# EAGLE design REV13.0 (EAGLE 9.2.2)
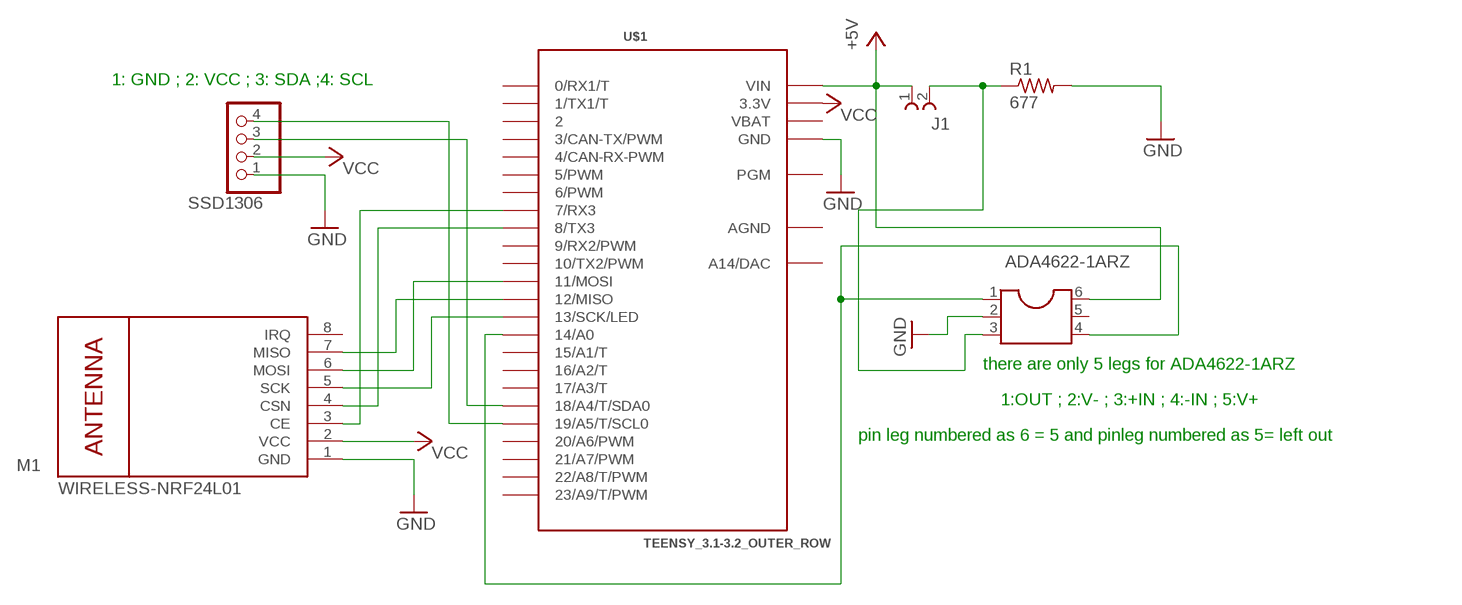
[diagram p0: schematic, sheet 1]

## Parts
ADA4622-1ARZ  DIL6/4  [DIL06-4]
J1  691214100002  [691214100002]
M1  WIRELESS-NRF24L01  [WIRELESS-NRF24L01]
R1  677  R-US_0204/5  [0204/5]
SSD1306  PINHD-1X4  [1X04]
U$1  TEENSY_3.1-3.2_OUTER_ROW  [TEENSY_3.0-3.2&LC_OUTER_ROW]

## Nets
+5V: ADA4622-1ARZ.6 J1.1 U$1.VIN
GND: ADA4622-1ARZ.2 M1.1(GND) R1.2 SSD1306.1 U$1.GND U$1.GND1(GND)
N$1: ADA4622-1ARZ.3 J1.2 R1.1
N$2: M1.5(SCK) U$1.13(13/SCK/LED)
N$3: M1.6(MOSI) U$1.11(11/MOSI)
N$4: M1.7(MISO) U$1.12(12/MISO)
N$5: M1.4(CSN) U$1.8(8/TX3)
N$6: M1.3(CE) U$1.7(7/RX3)
N$7: SSD1306.4 U$1.19/A5(19/A5/T/SCL0)
N$8: SSD1306.3 U$1.18/A4(18/A4/T/SDA0)
N$9: ADA4622-1ARZ.1 ADA4622-1ARZ.4 U$1.14/A0
VCC: M1.2(VCC) SSD1306.2 U$1.3.3V U$1.3.3V1(3.3V)
Unconnected: ADA4622-1ARZ.5 M1.8(IRQ) U$1.0(0/RX1/T) U$1.1(1/TX1/T) U$1.2 U$1.3(3/CAN-TX/PWM) U$1.4(4/CAN-RX-PWM) U$1.5(5/PWM) U$1.6(6/PWM) U$1.9(9/RX2/PWM) U$1.10(10/TX2/PWM) U$1.15/A1(15/A1/T) U$1.16/A2(16/A2/T) U$1.17/A3(17/A3/T) U$1.20/A6(20/A6/PWM) U$1.21/A7(21/A7/PWM) U$1.22/A8(22/A8/T/PWM) U$1.23/A9(23/A9/T/PWM) U$1.PGM U$1.RESET/DAC(A14/DAC)

## Notes on the sheet
- 1: GND ; 2: VCC ; 3: SDA ;4: SCL
- there are only 5 legs for ADA4622-1ARZ
- 1:OUT ; 2:V- ; 3:+IN ; 4:-IN ; 5:V+
- pin leg numbered as 6 = 5 and pinleg numbered as 5= left out

## Power pins joined to a net without a drawn wire
AGND: U$1.AGND
VBAT: U$1.VBAT

## Library data of the parts
ADA4622-1ARZ = ic-package:DIL6: Dual In Line / Socket
J1 = TerminalBlocks (rev17a):691214100002: SERIE 2141 - 3.50 MM - VERTICAL CABLE ENTRY WITH RISING CAGE CLAMP - WR-TBL =>ConTBL2 691214100002 Characteristics INSULATOR:PA6/66 FLAMABILITY RATING: UL94V0 COLOR: GREY METAL HOUSING: COPPER ALLOY / Ni+Sn TERMINAL SCREW: STEEL / Zn WIRE GUARD: COPPER ALLOY / Ni+Sn OPERATING TEMPERATURE:-30°C UP TO +120°C COMPLIANCE: LEAD FREE AND ROHS ELECTRICAL UL VDE CURRENT RATING: 10A 10A WORKING VOLTAGE: 300VAC 130VAC WITHSTANDING VOLTAGE: 1,6KV 1,25KV CONTACT RESISTANCE: 20 mOhm max 2015 (C) Wurth Elektronik
M1 = diy-modules:WIRELESS-NRF24L01: 2.4 GHz Wireless Module based on NRF24L01 chip More details available here: http://www.electrodragon.com/w/NRF24L01 Click here to find device on ebay.com <http://www.ebay.com/sch/nrf24l01+arduino>
R1 = adafruit:R-US_: RESISTOR, American symbol
SSD1306 = pinhead:PINHD-1X4: PIN HEADER
U$1 = Teensy_3_and_LC_Series_Boards_v1.4:TEENSY_3.1-3.2_OUTER_ROW: Footprint for Teensy 3.1 or 3.2 board using all pin connections on the outer perimeter

## Net classes
0 default: width 0.508 mm, drill 0.381 mm, clearance 0.381 mm

## Board
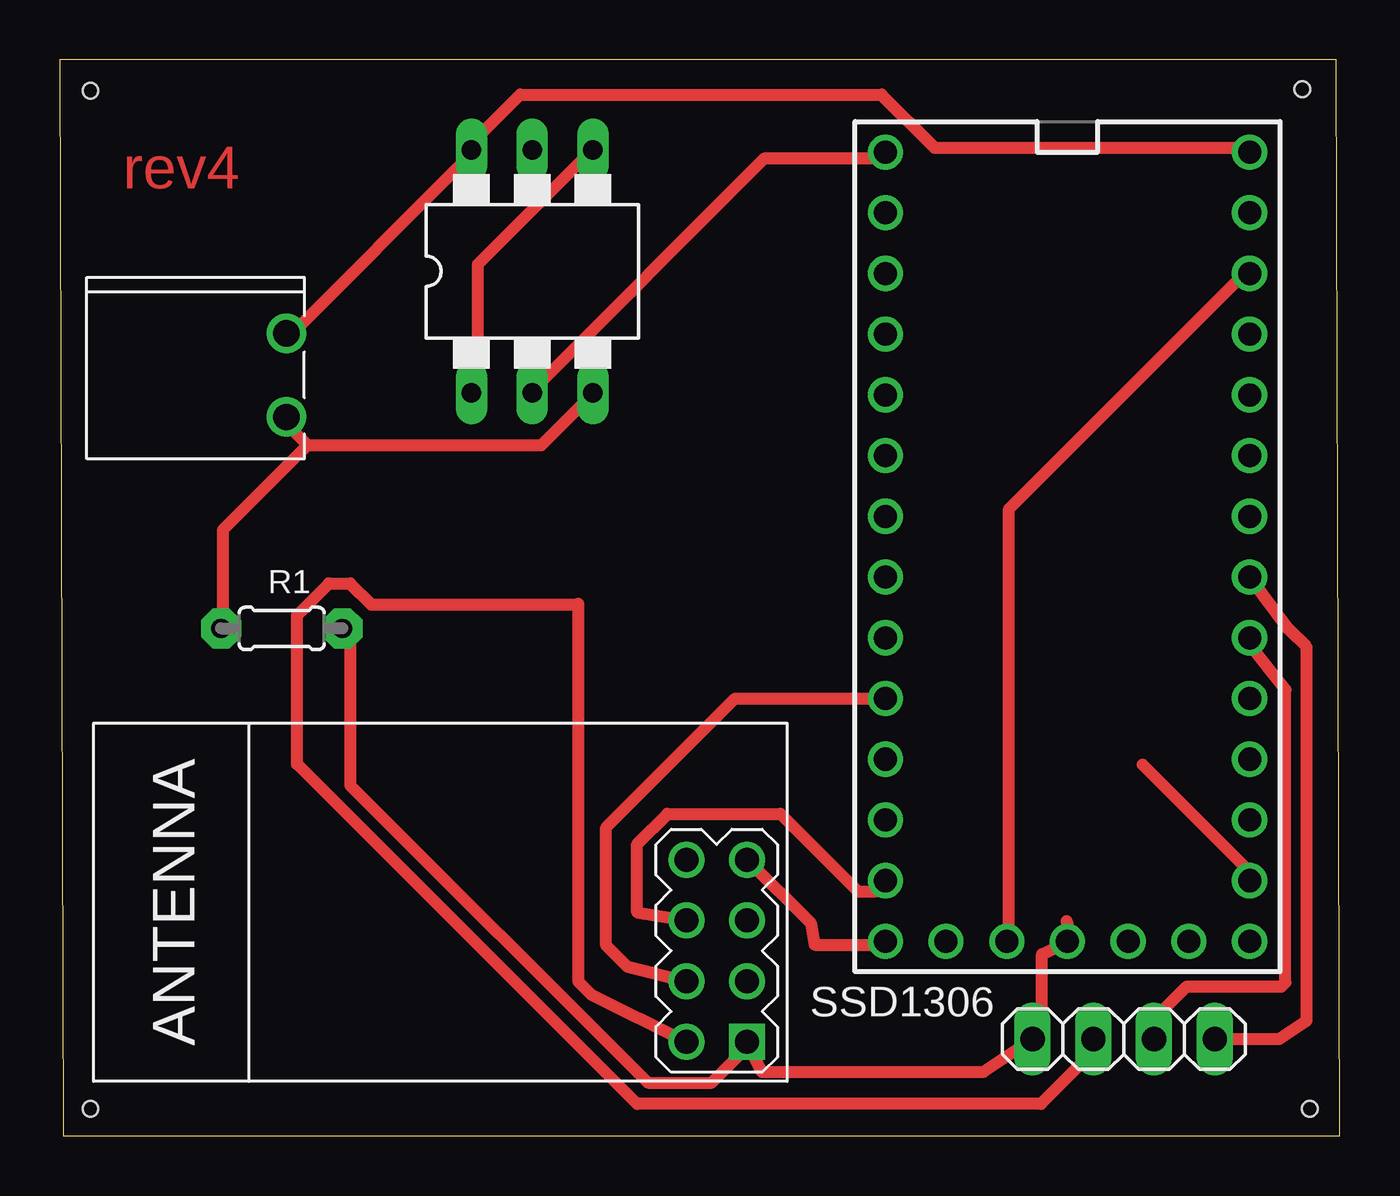
[diagram p1: board, top side]
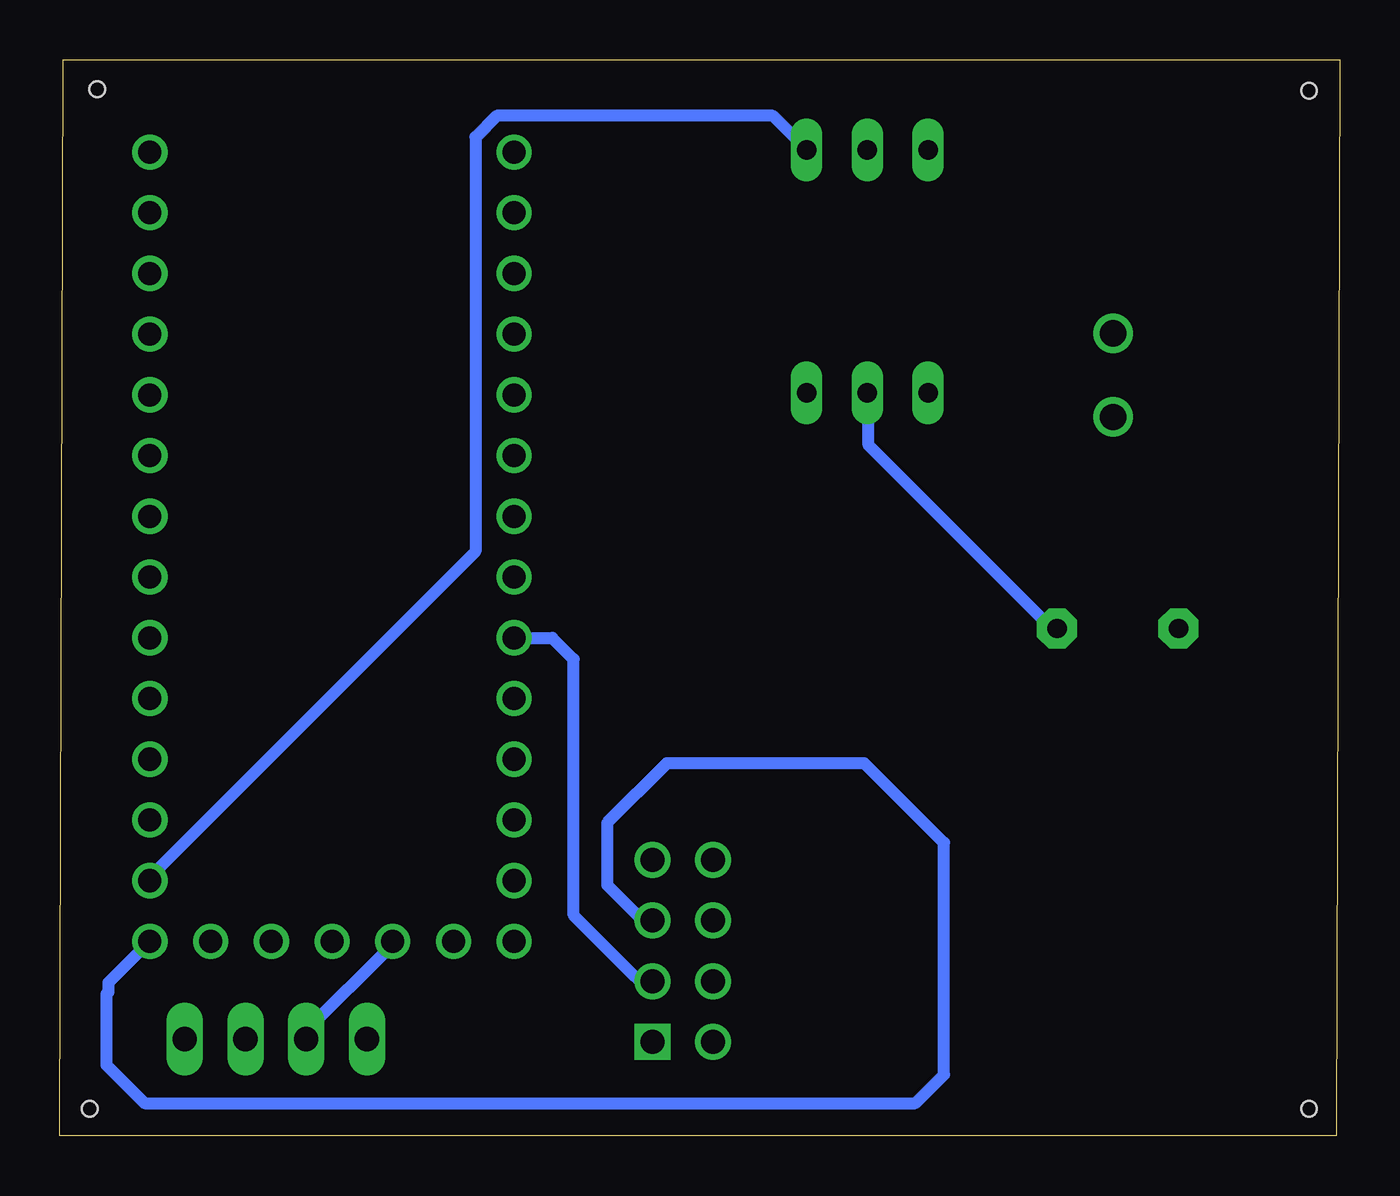
[diagram p2: board, bottom side, seen from below]

Size 53.54 x 45.02 mm. Coordinates in mm from the lower left corner, seen from the top.
Outline: 0.15,0 53.54,0 53.39,45.02 0,45.02 0.15,0
Copper layers (1*16): Top 0.035mm / dielectric 1.5mm / Bottom 0.035mm
Design rules "default": minimum track width 6mil, minimum drill 0.35mm, track to track 6mil, track to pad 6mil, pad to pad 6mil, via to via 6mil, smd to smd 6mil, copper to edge 40mil, drill to drill 6mil, minimum pad ring 10mil, minimum via ring 8mil, stop-mask expansion 4mil, vias tented up to drill 0mil, thermal gap 10mil
Holes 0.65 mm at 1.28,43.72 1.28,1.13 51.98,43.79 52.28,1.13

### Footprints (pad centres in the part's own frame; a part is rotated, then mirrored left to right if it is on the bottom)
DIL06-4 = drill 0.813 long: 1 -2.54,-5.08; 2 0,-5.08; 3 2.54,-5.08; 4 2.54,5.08; 5 0,5.08; 6 -2.54,5.08
691214100002 = drill 1.1: 1 -1.75,0; 2 1.75,0
WIRELESS-NRF24L01 = drill 1 square: 1 -12.7,6.35 | drill 1: 2 -10.16,6.35; 3 -12.7,3.81; 4 -10.16,3.81; 5 -12.7,1.27; 6 -10.16,1.27; 7 -12.7,-1.27; 8 -10.16,-1.27
0204/5 = drill 0.813 pad 1.676 octagon: 1 -2.54,0; 2 2.54,0
1X04 = drill 1.016 long: 1 -3.81,0; 2 -1.27,0; 3 1.27,0; 4 3.81,0
TEENSY_3.0-3.2&LC_OUTER_ROW = drill 0.965: 0 -7.62,13.97; 1 -7.62,11.43; 2 -7.62,8.89; 3 -7.62,6.35; 3.3V 7.62,11.43; 3.3V1 -2.54,-16.51; 4 -7.62,3.81; 5 -7.62,1.27; 6 -7.62,-1.27; 7 -7.62,-3.81; 8 -7.62,-6.35; 9 -7.62,-8.89; 10 -7.62,-11.43; 11 -7.62,-13.97; 12 -7.62,-16.51; 13 7.62,-16.51; 14/A0 7.62,-13.97; 15/A1 7.62,-11.43; 16/A2 7.62,-8.89; 17/A3 7.62,-6.35; 18/A4 7.62,-3.81; 19/A5 7.62,-1.27; 20/A6 7.62,1.27; 21/A7 7.62,3.81; 22/A8 7.62,6.35; 23/A9 7.62,8.89; AGND 7.62,13.97; GND -7.62,16.51; GND1 0,-16.51; PGM 2.54,-16.51; RESET/DAC 5.08,-16.51; VBAT -5.08,-16.51; VIN 7.62,16.51

### Placement (x,y rotation side)
ADA4622-1ARZ  19.76,36.17 0 top
J1  9.48,31.82 270 top
M1  16.05,10.28 180 top
R1  9.28,21.23 0 top
SSD1306  44.51,4.05 0 top
U$1  42.15,24.65 0 top

### Tracks (layer width: path | path; a pad name or v marks a point on that pad's centre or on a via)
+5V
  Top 0.508: J1.1 9.48,33.34 17.04,40.89 ADA4622-1ARZ.6 17.04,41.34 19.26,43.56 34.38,43.56 36.6,41.34 49.49,41.34 U$1.VIN
GND
  Top 0.508: 42.12,8.99 42.15,8.89 U$1.GND1 41.09,7.6 41.09,4.24 SSD1306.1 38.63,2.67 29.38,2.67 M1.1 28.6,3.56 27.26,2.22 24.6,2.22 12.15,14.67 12.15,20.89 R1.2 | U$1.GND 34.38,40.89 29.49,40.89 19.71,31.11 ADA4622-1ARZ.2
  Bottom 0.508: ADA4622-1ARZ.2 19.71,30.67 19.71,28.89 12.15,21.34 R1.2
N$1
  Top 0.508: 10.37,28.89 20.15,28.89 21.93,30.67 ADA4622-1ARZ.3 | 10.37,28.89 9.48,29.78 J1.2 | 10.37,28.89 6.82,25.34 6.82,21.34 R1.1
N$2
  Bottom 0.508: M1.5 29.25,9.1 30.64,10.49 30.64,13.09 28.14,15.59 19.88,15.59 16.56,12.26 16.56,2.56 17.76,1.36 50,1.36 51.6,2.97 51.6,5.94 51.51,6.03 51.51,6.4 U$1.13 49.93,8 49.84,8 49.84,8.19
N$3
  Top 0.508: U$1.11 34.08,10.22 33.39,10.22 30.14,13.47 25.41,13.47 24.15,12.21 24.15,9.36 M1.6
N$4
  Top 0.508: U$1.12 34.51,8 31.58,8 31.44,8.86 M1.7
N$5
  Top 0.508: U$1.8 28.25,18.3 22.86,12.9 22.86,7.96 23.73,7.09 M1.4
N$6
  Bottom 0.508: U$1.7 32.95,20.84 32.05,19.94 32.05,9.23 29.47,6.65 M1.3
N$7
  Top 0.508: U$1.19/A5 51.42,21.18 52.16,20.45 52.16,4.82 51,4.05 SSD1306.4
N$8
  Top 0.508: SSD1306.3 45.78,4.88 47.15,6.25 51.12,6.25 51.27,6.41 51.27,18.67 49.77,20.54 U$1.18/A4
N$9
  Top 0.508: 45.29,15.54 49.77,11.05 U$1.14/A0 | ADA4622-1ARZ.1 17.48,31.11 17.48,36.45 21.93,40.89 ADA4622-1ARZ.4
  Bottom 0.508: U$1.14/A0 49.49,11.11 36.15,24.45 36.15,41.78 35.26,42.67 23.71,42.67 22.37,41.34 ADA4622-1ARZ.4
VCC
  Top 0.508: 21.68,22.27 21.68,22.23 | 21.68,22.23 21.68,6.47 22.23,5.92 M1.2 | U$1.3.3V 49.49,36.01 39.71,26.23 39.71,8.45 U$1.3.3V1 | 21.68,22.23 13.04,22.23 12.15,23.11 11.26,23.11 9.93,21.78 9.93,15.56 24.15,1.33 41.04,1.33 42.82,3.11 42.82,4 SSD1306.2
  Bottom 0.508: SSD1306.2 43.24,4.41 39.71,7.94 39.71,8.11 U$1.3.3V1 39.71,8.33

### Text on the board
Top: rev4